# EAGLE design u10-small (EAGLE 6.5.0)
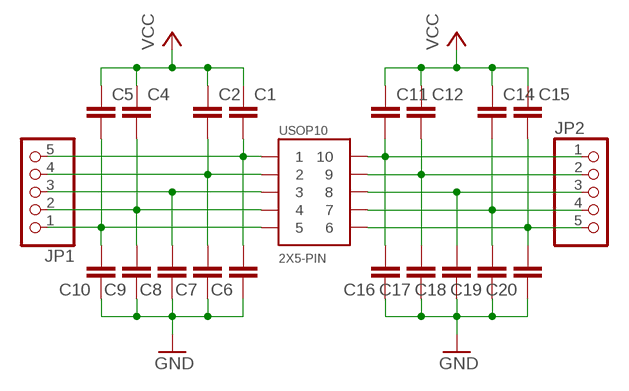
[diagram p0: schematic, sheet 1]

## Parts
C1  C-EUC0603  [C0603]
C2  C-EUC0603  [C0603]
C4  C-EUC0603  [C0603]
C5  C-EUC0603  [C0603]
C6  C-EUC0805  [C0805]
C7  C-EUC0805  [C0805]
C8  C-EUC0805  [C0805]
C9  C-EUC0805  [C0805]
C10  C-EUC0805  [C0805]
C11  C-EUC0603  [C0603]
C12  C-EUC0603  [C0603]
C14  C-EUC0603  [C0603]
C15  C-EUC0603  [C0603]
C16  C-EUC0805  [C0805]
C17  C-EUC0805  [C0805]
C18  C-EUC0805  [C0805]
C19  C-EUC0805  [C0805]
C20  C-EUC0805  [C0805]
JP1  PINHD-1X5  [1X05]
JP2  PINHD-1X5  [1X05]
USOP10  2X5-PIN  [USOP10]

## Nets
1: C1.2 C6.2 JP1.5 USOP10.P$1
2: C2.2 C7.2 JP1.4 USOP10.P$2
3: C8.2 JP1.3 USOP10.P$3
4: C4.2 C9.2 JP1.2 USOP10.P$4
5: C5.2 C10.2 JP1.1 USOP10.P$5
GND: C6.1 C7.1 C8.1 C9.1 C10.1 C16.1 C17.1 C18.1 C19.1 C20.1
N$6: C15.2 C20.2 JP2.5 USOP10.P$6
N$7: C14.2 C19.2 JP2.4 USOP10.P$7
N$8: C18.2 JP2.3 USOP10.P$8
N$9: C12.2 C17.2 JP2.2 USOP10.P$9
N$10: C11.2 C16.2 JP2.1 USOP10.P$10
VCC: C1.1 C2.1 C4.1 C5.1 C11.1 C12.1 C14.1 C15.1

## Library data of the parts
C1 C2 C4-C12 C14-C20 = p.peter-rcl:C-EU: CAPACITOR, European symbol
JP1 JP2 = pinhead:PINHD-1X5: PIN HEADER
USOP10 = p.peter-pacakages:2X5-PIN

## Board
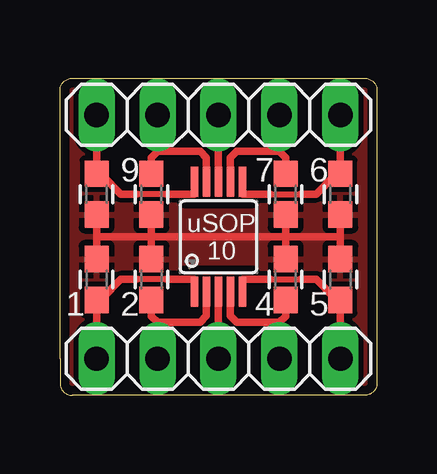
[diagram p1: board, top side]
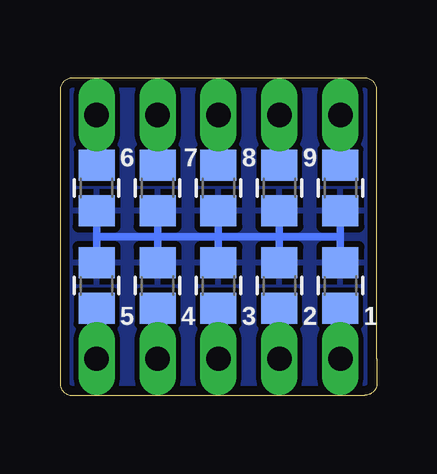
[diagram p2: board, bottom side, seen from below]

Size 13.21 x 13.21 mm. Coordinates in mm from the lower left corner, seen from the top.
Outline: 0,1.52 0,12.7 arc-90 0.51,13.21 11.68,13.21 12.7,13.21 arc-90 13.21,12.7 13.21,1.52 13.21,0.51 arc-90 12.7,0 0.51,0 arc-90 0,0.51 0,1.52
Copper layers (1*16): Top 0.0356mm / dielectric 1.5011mm / Bottom 0.0356mm
Design rules "oshpark": minimum track width 6mil, minimum drill 13mil, track to track 6mil, track to pad 6mil, pad to pad 6mil, via to via 6mil, smd to smd 6mil, copper to edge 15mil, drill to drill 6mil, minimum pad ring 7mil, minimum via ring 7mil, stop-mask expansion 4mil, vias tented up to drill 4.1mm, thermal gap 10mil
tRestrict: 6 lines

### Footprints (pad centres in the part's own frame; a part is rotated, then mirrored left to right if it is on the bottom)
C0603 = smd 1.1 x 1: 1 -0.85,0; 2 0.85,0
C0805 = smd 1.3 x 1.5: 1 -0.95,0; 2 0.95,0
1X05 = drill 1.016 long: 1 -5.08,0; 2 -2.54,0; 3 0,0; 4 2.54,0; 5 5.08,0
USOP10 = smd 0.3 x 1.25: P$1 -1,-2.3; P$2 -0.5,-2.3; P$3 0,-2.3; P$4 0.5,-2.3; P$5 1,-2.3; P$6 1,2.3; P$7 0.5,2.3; P$8 0,2.3; P$9 -0.5,2.3; P$10 -1,2.3

### Placement (x,y rotation side)
C1  1.52,4.83 270 top
C2  3.81,4.83 270 top
C4  9.4,4.83 270 top
C5  11.68,4.83 270 top
C6  1.52,4.57 270 bottom
C7  4.06,4.57 270 bottom
C8  6.6,4.57 270 bottom
C9  9.14,4.57 270 bottom
C10  11.68,4.57 270 bottom
C11  1.52,8.38 90 top
C12  3.81,8.38 90 top
C14  9.4,8.38 90 top
C15  11.68,8.38 90 top
C16  1.52,8.64 90 bottom
C17  4.06,8.64 90 bottom
C18  6.6,8.64 90 bottom
C19  9.14,8.64 90 bottom
C20  11.68,8.64 90 bottom
JP1  6.6,1.52 180 top
JP2  6.6,11.68 0 top
USOP10  6.6,6.6 0 top

### Tracks (layer width: path | path; a pad name or v marks a point on that pad's centre or on a via)
1
  Top 0.254: 5.6,4.81 5.59,4.83 | 4.45,4.83 3.17,4.83 | 1.78,4.06 1.61,4.06 | 1.61,4.06 C1.2 | 1.61,4.06 1.52,4.06
  Top 0.305: USOP10.P$1 5.6,4.81 | 5.59,4.83 4.45,4.83 | 3.17,4.83 2.54,4.83 1.78,4.06 | 1.52,4.06 JP1.5
  Bottom 0.813: C6.2 1.52,3.56 JP1.5
2
  Top 0.305: USOP10.P$2 6.1,3.31 5.84,3.05 4.06,3.05 | C2.2 3.81,3.3 4.06,3.05 | 4.06,3.05 JP1.4
  Bottom 0.813: C7.2 JP1.4
3
  Top 0.305: USOP10.P$3 JP1.3
  Bottom 0.813: C8.2 JP1.3
4
  Top 0.254: 9.4,3.3 C4.2
  Top 0.305: USOP10.P$4 7.1,3.31 7.37,3.05 9.14,3.05 | C4.2 9.4,3.3 9.14,3.05 | 9.14,3.05 JP1.2
  Bottom 0.813: C9.2 JP1.2
5
  Top 0.254: 7.6,4.81 7.62,4.83 | 8.76,4.83 10.03,4.83 | 11.43,4.06 11.6,4.06 C5.2
  Top 0.305: USOP10.P$5 7.6,4.81 | 7.62,4.83 8.76,4.83 | 10.03,4.83 10.67,4.83 11.43,4.06 | C5.2 JP1.1
  Bottom 0.813: C10.2 JP1.1
GND
  Bottom 0.305: C16.1 1.52,6.6 | 1.52,6.6 C6.1 | C17.1 4.06,6.6 | 4.06,6.6 C7.1 4.06,6.6 | 6.6,6.6 C18.1 6.6,6.6 | 6.6,6.6 C8.1 | 9.14,6.6 C19.1 9.14,6.6 | 9.14,6.6 C9.1 | C20.1 11.68,6.6 | 11.68,6.6 9.14,6.6 | 9.14,6.6 6.6,6.6 | 6.6,6.6 4.06,6.6 | 4.06,6.6 1.52,6.6 | 11.68,6.6 C10.1
  pour Bottom (isolate 0.203): 0.25,0.25 0.25,12.95 12.95,12.95 12.95,0.25
N$6
  Top 0.254: 7.6,8.4 7.62,8.38 | 8.76,8.38 10.03,8.38 | C15.2 11.6,9.14 11.6,9.56 11.68,9.65
  Top 0.305: USOP10.P$6 7.6,8.4 | 7.62,8.38 8.76,8.38 | 10.03,8.38 10.67,8.38 11.43,9.14 11.6,9.14 | 11.68,9.65 JP2.5
  Bottom 0.813: C20.2 JP2.5
N$7
  Top 0.305: USOP10.P$7 7.1,9.9 7.37,10.16 9.14,10.16 | 9.14,10.16 JP2.4 | C14.2 9.4,9.91 9.14,10.16
  Bottom 0.813: C19.2 JP2.4
N$8
  Top 0.305: USOP10.P$8 JP2.3
  Bottom 0.813: C18.2 JP2.3
N$9
  Top 0.305: USOP10.P$9 6.1,9.9 5.84,10.16 4.06,10.16 | C12.2 3.81,9.91 4.06,10.16 | 4.06,10.16 JP2.2
  Bottom 0.813: C17.2 JP2.2
N$10
  Top 0.254: USOP10.P$10 5.59,8.9 5.59,8.38 | 4.45,8.38 3.17,8.38 | C11.2 1.61,9.14 1.52,9.14
  Top 0.305: 5.59,8.38 4.45,8.38 | 3.17,8.38 2.79,8.38 2.54,8.38 1.78,9.14 1.61,9.14 | 1.52,9.14 JP2.1
  Bottom 0.813: C16.2 JP2.1
VCC
  Top 0.254: C1.1 1.52,6.6 | C2.1 3.81,6.6 | 9.4,6.6 C14.1
  Top 0.305: 1.52,6.6 C11.1 | 3.81,6.6 C12.1 | C4.1 9.4,6.6 | C5.1 11.68,6.6 | 11.68,6.6 C15.1 | C1.1 1.52,6.6 | 1.52,6.6 3.81,6.6 | 3.81,6.6 9.4,6.6 | 9.4,6.6 11.68,6.6 | C2.1 3.81,6.6 | C14.1 9.4,6.6
  pour Top (isolate 0.203): 0.25,0.25 0.25,12.95 12.95,12.95 12.95,0.25

### Text on the board
tPlace: 9 | 7 | 6 | uSOP / 10 | 1 | 2 | 4 | 5
bPlace: 9 | 8 | 7 | 6 | 1 | 2 | 3 | 4 | 5